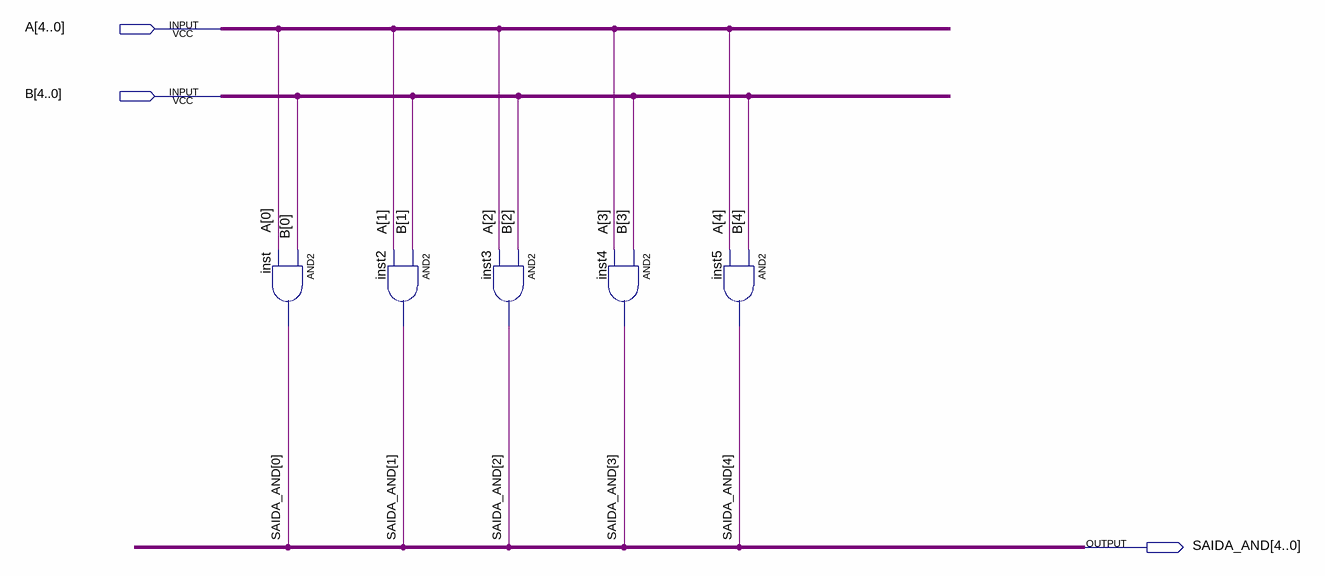
[diagram p0: schematic sheet]
// Quartus schematic modulo_and.bdf as structural Verilog: 5 symbols, 3 pins
module modulo_and (
  input  [4:0] A,
  input  [4:0] B,
  output [4:0] SAIDA_AND
);

  and inst (SAIDA_AND[0], B[0], A[0]);
  and inst2 (SAIDA_AND[1], B[1], A[1]);
  and inst3 (SAIDA_AND[2], B[2], A[2]);
  and inst4 (SAIDA_AND[3], B[3], A[3]);
  and inst5 (SAIDA_AND[4], B[4], A[4]);
endmodule
